# Altium schematic sheet SiLPA_HE_MCU.SchDoc: SiLPA HE
size 420 x 297 mm; EDA_Number: ARTIQ; Projet: ARTIQ/SINARA; Author: G.Kasprowicz; CompanyName: WUT ISE; DrawnBy: G.Kasprowicz; Organization: WUT ISE; Address1: PW ISE; Address2: Nowowiejska 15/19 00-665 Warsaw; Address3: gkasprow@gmail.com; DocumentNumber: 6; Revision: 1; SheetNumber: 7; SheetTotal: 9; ModifiedBy: -; CheckedDate: -; Title2: MCU; DivGrp: WUT ISE; Designer: G.Kasprowicz; ModifiedDate: -; ProjectName: Sensor Box
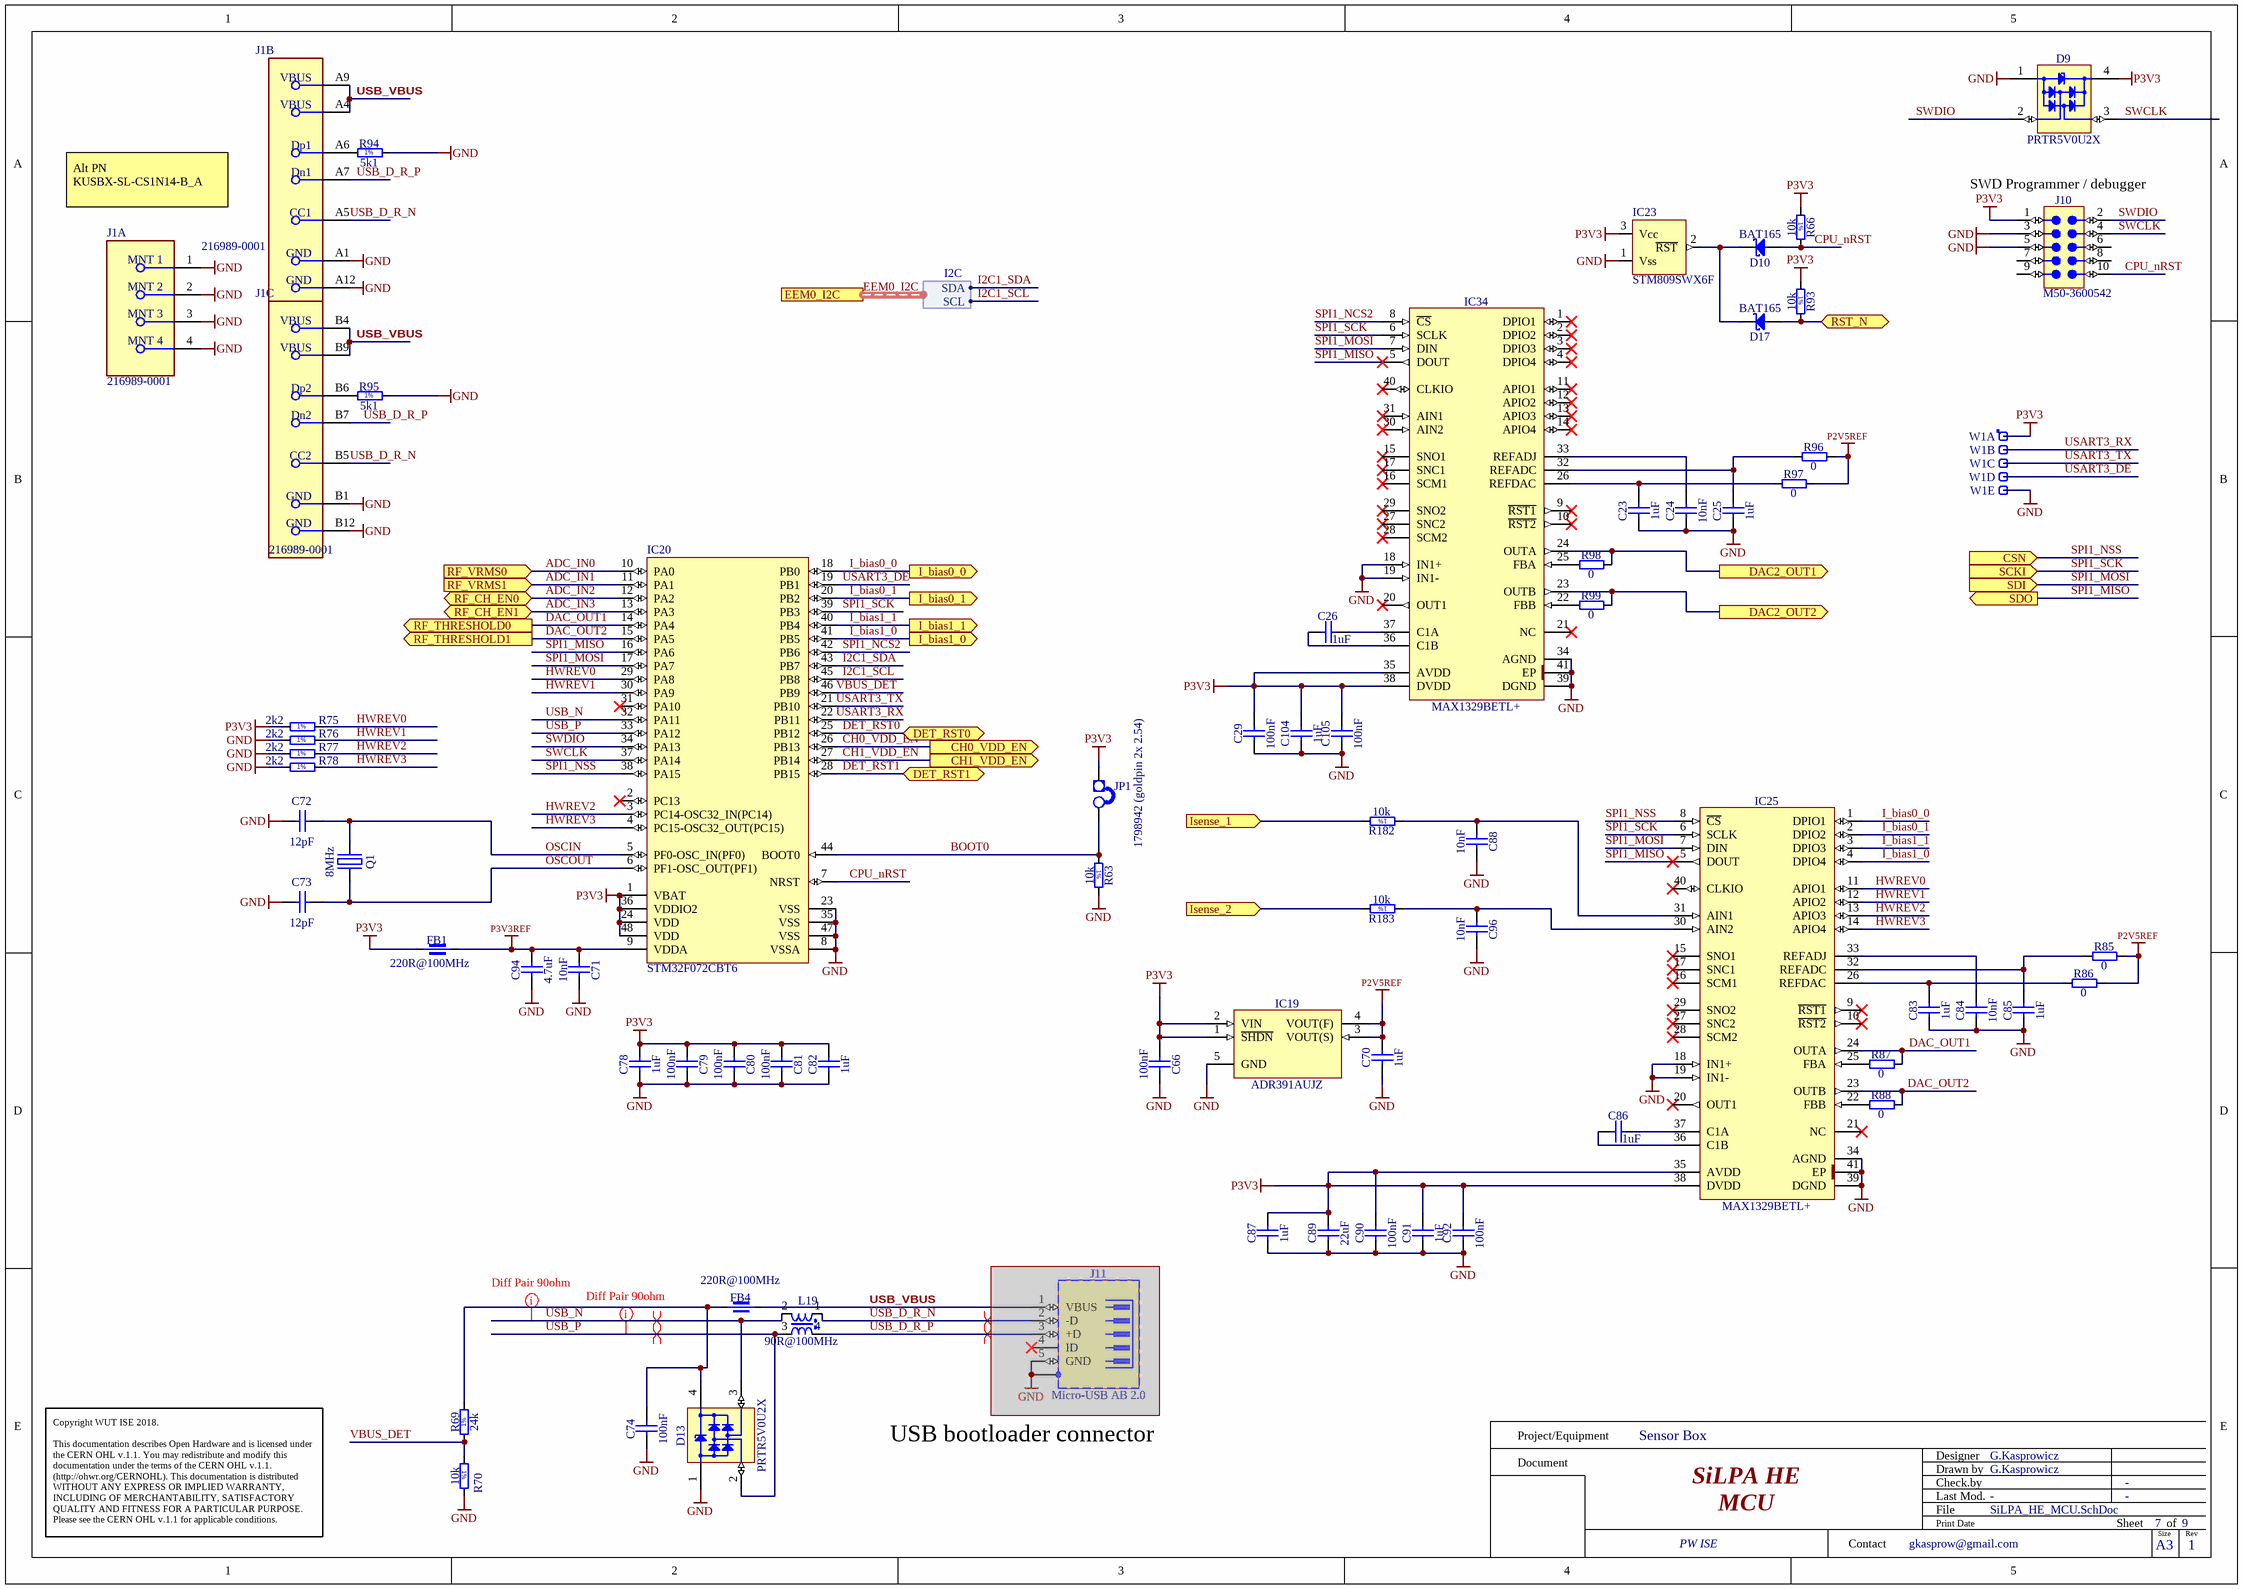
[diagram p0: SiLPA_HE_MCU.SchDoc]

## Parts
C23  1uF  [CAPC1005X55N]
C24  10nF  [CAPC1005X55N]
C25  1uF  [CAPC1005X55N]
C26  1uF  [CAPC1005X55N]
C29  100nF  [CAPC1005X55N]
C66  100nF  [CAPC1005X55N]
C70  1uF  [CAPC1608X87N]
C71  10nF  [CAPC1005X55N]
C72  12pF  [CAPC1005X55N]
C73  12pF  [CAPC1005X55N]
C74  100nF  [CAPC1005X55N]
C78  1uF  [CAPC1608X87N]
C79  100nF  [CAPC1005X55N]
C80  100nF  [CAPC1005X55N]
C81  100nF  [CAPC1005X55N]
C82  1uF  [CAPC1608X87N]
C83  1uF  [CAPC1005X55N]
C84  10nF  [CAPC1005X55N]
C85  1uF  [CAPC1005X55N]
C86  1uF  [CAPC1005X55N]
C87  1uF  [CAPC1608X87N]
C88  10nF  [CAPC1005X55N]
C89  22uF  [CAPC1608X90N]
C90  100nF  [CAPC1005X55N]
C91  1uF  [CAPC1608X87N]
C92  100nF  [CAPC1005X55N]
C94  4.7uF  [CAPC1709X95N]
C96  10nF  [CAPC1005X55N]
C104  1uF  [CAPC1608X87N]
C105  100nF  [CAPC1005X55N]
D9  PRTR5V0U2X  [SOT190P230X110-4N]
D10  BAT165  [SOD2512X110N]
D13  PRTR5V0U2X  [SOT190P230X110-4N]
D17  BAT165  [SOD2512X110N]
FB1  220R@100MHz  [INDC1005X55N]
FB4  220R@100MHz  [INDC1005X55N]
IC19  ADR391AUJZ  [SOT95P280X100-5N]
IC20  STM32F072CBT6  [STM-LQFP48_M]
IC23  STM809SWX6F  [SOT-23]
IC25  MAX1329BETL+  [QFN50P600X600X80-41N-S425]
IC34  MAX1329BETL+  [QFN50P600X600X80-41N-S425]
J1  216989-0001  [FP-2169890001-MFG]  (parts A,B,C of 3)
J10  Manufacturer Part Number: M50-3600542  [HARWIN_M50-3600542]  (hidden comment: Header 10)
J11  Micro-USB AB 2.0  [HIROSE_ZX62RD-AB-5P8]  (masked out: inside a compile mask, not in the netlist)
JP1  1798942 (goldpin 2x 2.54)  [jump]
L19  90R@100MHz  [IND_MURATA_DLW21S]
Q1  8MHz  [XTAL_TXC_7A]
R63  10k  [RESC1005X40N]
R66  10k  [RESC1005X40N]
R69  24k  [RESC1608X55N]
R70  10k  [RESC1005X40N]
R75  2k2  [RESC1005X40N]
R76  2k2  [RESC1005X40N]
R77  2k2  [RESC1005X40N]
R78  2k2  [RESC1005X40N]
R85  0  [RESC1005X40N]
R86  0  [RESC1005X40N]
R87  0  [RESC1005X40N]
R88  0  [RESC1005X40N]
R93  10k  [RESC1005X40N]
R94  5k1  [RESC1005X40N]
R95  5k1  [RESC1005X40N]
R96  0  [RESC1005X40N]
R97  0  [RESC1005X40N]
R98  0  [RESC1005X40N]
R99  0  [RESC1005X40N]
R182  10k  [RESC1005X40N]
R183  10k  [RESC1005X40N]
W1  Header 5  [SAMTEC_HTSW-105-23-L-S]  (value not drawn)  (parts A,B,C,D,E of 5)

## Ports
CH0_VDD_EN (out), CH1_VDD_EN (out), CSN (in), DAC2_OUT1 (out), DAC2_OUT2 (out), DET_RST0 (bidir), DET_RST1 (bidir), EEM0_I2C (harness I2C), I_bias0_0 (out), I_bias0_1 (out), I_bias1_0 (out), I_bias1_1 (out), Isense_1 (in), Isense_2 (in), RF_CH_EN0 (bidir), RF_CH_EN1 (bidir), RF_THRESHOLD0 (out), RF_THRESHOLD1 (out), RF_VRMS0 (in), RF_VRMS1 (in), RST_N (bidir), SCKI (in), SDI (in), SDO (out)

## Harnesses
I2C: SDA, SCL

## Nets
GND: C23.1 C24.1 C25.1 C29.1 C66.2 C70.1 C71.2 C72.2 C73.2 C74.1 C78.1 C79.2 C80.2 C81.2 C82.1 C83.1 C84.1 C85.1 C87.1 C88.2 C89.1 C90.1 C91.1 C92.1 C94.1 C96.2 C104.1 C105.1 D9.1(GND) D13.1(GND) IC19.5(GND) IC20.8(VSSA) IC20.23(VSS) IC20.35(VSS) IC20.47(VSS) IC23.1(Vss) IC25.18(IN1+) IC25.19(IN1-) IC25.34(AGND) IC25.39(DGND) IC25.41(EP) IC34.18(IN1+) IC34.19(IN1-) IC34.34(AGND) IC34.39(DGND) IC34.41(EP) J1.1(MNT_1) J1.2(MNT_2) J1.3(MNT_3) J1.4(MNT_4) J1.A1(GND) J1.A12(GND) J1.B1(GND) J1.B12(GND) J10.3 J10.5 R63.2 R70.2 R76.1 R77.1 R78.1 R94.2 R95.2 W1.5
P2V5REF: C70.2 IC19.3(VOUT(S)) IC19.4(VOUT(F)) R85.2 R86.2 R96.2 R97.2
P3V3: C29.2 C66.1 C78.2 C79.1 C80.1 C81.1 C82.2 C87.2 C89.2 C90.2 C91.2 C92.2 C104.2 C105.2 D9.4(VCC) FB1.1 IC19.1(~{SHDN}) IC19.2(VIN) IC20.1(VBAT) IC20.24(VDD) IC20.36(VDDIO2) IC20.48(VDD) IC23.3(Vcc) IC25.35(AVDD) IC25.38(DVDD) IC34.35(AVDD) IC34.38(DVDD) J10.1 JP1.1(E1) R66.1 R75.1 R93.1 W1.1
P3V3REF: C71.1 C94.2 FB1.2 IC20.9(VDDA)
ADC_IN0: IC20.10(PA0) ; port RF_VRMS0
ADC_IN1: IC20.11(PA1) ; port RF_VRMS1
ADC_IN2: IC20.12(PA2) ; port RF_CH_EN0
ADC_IN3: IC20.13(PA3) ; port RF_CH_EN1
BOOT0: IC20.44(BOOT0) JP1.2(E2) R63.1
CH0_VDD_EN: IC20.26(PB13) ; port CH0_VDD_EN
CH1_VDD_EN: IC20.27(PB14) ; port CH1_VDD_EN
CPU_nRST: D10.2(A) IC20.7(NRST) J10.10 R66.2
DAC2_OUT1: IC34.24(OUTA) R98.2 ; port DAC2_OUT1
DAC2_OUT2: IC34.23(OUTB) R99.2 ; port DAC2_OUT2
DAC_OUT1: IC20.14(PA4) IC25.24(OUTA) R87.2 ; port RF_THRESHOLD0
DAC_OUT2: IC20.15(PA5) IC25.23(OUTB) R88.2 ; port RF_THRESHOLD1
DET_RST0: IC20.25(PB12) ; port DET_RST0
DET_RST1: IC20.28(PB15) ; port DET_RST1
HWREV0: IC20.29(PA8) IC25.11(APIO1) R75.2
HWREV1: IC20.30(PA9) IC25.12(APIO2) R76.2
HWREV2: IC20.3(PC14-OSC32_IN(PC14)) IC25.13(APIO3) R77.2
HWREV3: IC20.4(PC15-OSC32_OUT(PC15)) IC25.14(APIO4) R78.2
I2C1_SCL: IC20.45(PB8) ; port EEM0_I2C.SCL  [project net EEM0_I2C.SCL]
I2C1_SDA: IC20.43(PB7) ; port EEM0_I2C.SDA  [project net EEM0_I2C.SDA]
I_bias0_0: IC20.18(PB0) IC25.1(DPIO1) ; port I_bias0_0
I_bias0_1: IC20.20(PB2) IC25.2(DPIO2) ; port I_bias0_1
I_bias1_0: IC20.41(PB5) IC25.4(DPIO4) ; port I_bias1_0
I_bias1_1: IC20.40(PB4) IC25.3(DPIO3) ; port I_bias1_1
Isense_1: R182.2 ; port Isense_1
Isense_2: R183.2 ; port Isense_2
OSCIN: C72.1 IC20.5(PF0-OSC_IN(PF0)) Q1.1(OSC1)
OSCOUT: C73.1 IC20.6(PF1-OSC_OUT(PF1)) Q1.2(OSC2)
RST_N: D17.2(A) R93.2 ; port RST_N
SPI1_MISO: IC20.16(PA6) IC25.5(DOUT) IC34.5(DOUT) ; port SDO
SPI1_MOSI: IC20.17(PA7) IC25.7(DIN) IC34.7(DIN) ; port SDI
SPI1_NCS2: IC20.42(PB6) IC34.8(~{CS})
SPI1_NSS: IC20.38(PA15) IC25.8(~{CS}) ; port CSN
SPI1_SCK: IC20.39(PB3) IC25.6(SCLK) IC34.6(SCLK) ; port SCKI
SWCLK: D9.3(I/O2) IC20.37(PA14) J10.4
SWDIO: D9.2(I/O1) IC20.34(PA13) J10.2
USART3_DE: IC20.19(PB1) W1.4
USART3_RX: IC20.22(PB11) W1.2
USART3_TX: IC20.21(PB10) W1.3
USB_D_R_N: J1.A5(CC1) J1.B5(CC2) L19.1
USB_D_R_P: J1.A7(Dn1) J1.B7(Dn2) L19.4
USB_N: D13.3(I/O2) IC20.32(PA11) L19.2
USB_P: D13.2(I/O1) IC20.33(PA12) L19.3
USB_VBUS: FB4.2 J1.A4(VBUS) J1.A9(VBUS) J1.B4(VBUS) J1.B9(VBUS)
VBUS_DET: IC20.46(PB9) R69.1 R70.1
NetC23_2: C23.2 IC34.26(REFDAC) R97.1
NetC24_2: C24.2 IC34.33(REFADJ)
NetC25_2: C25.2 IC34.32(REFADC) R96.1
NetC26_1: C26.1 IC34.36(C1B)
NetC26_2: C26.2 IC34.37(C1A)
NetC74_2: C74.2 D13.4(VCC) FB4.1 R69.2
NetC83_2: C83.2 IC25.26(REFDAC) R86.1
NetC84_2: C84.2 IC25.33(REFADJ)
NetC85_2: C85.2 IC25.32(REFADC) R85.1
NetC86_1: C86.1 IC25.36(C1B)
NetC86_2: C86.2 IC25.37(C1A)
NetC88_1: C88.1 IC25.31(AIN1) R182.1
NetC96_1: C96.1 IC25.30(AIN2) R183.1
NetD10_1: D10.1(C) D17.1(C) IC23.2(~{RST})
NetIC25_22: IC25.22(FBB) R88.1
NetIC25_25: IC25.25(FBA) R87.1
NetIC34_22: IC34.22(FBB) R99.1
NetIC34_25: IC34.25(FBA) R98.1
NetJ1_A6: J1.A6(Dp1) R94.1
NetJ1_B6: J1.B6(Dp2) R95.1

Not connected (* = marked no-connect by the designer): IC20 2(PC13)* 31(PA10)*; IC25 9(~{RST1})* 10(~{RST2})* 15(SNO1)* 16(SCM1)* 17(SNC1)* 20(OUT1)* 21(NC)* 27(SNC2)* 28(SCM2)* 29(SNO2)* 40(CLKIO)*; IC34 1(DPIO1)* 2(DPIO2)* 3(DPIO3)* 4(DPIO4)* 9(~{RST1})* 10(~{RST2})* 11(APIO1)* 12(APIO2)* 13(APIO3)* 14(APIO4)* 15(SNO1)* 16(SCM1)* 17(SNC1)* 20(OUT1)* 21(NC)* 27(SNC2)* 28(SCM2)* 29(SNO2)* 30(AIN2)* 31(AIN1)* 40(CLKIO)*; J10 6 7 8 9

## Buses and harness runs
harness EEM0_I2C = port EEM0_I2C

## Layout directives
mark named Diff Pair 90ohm: USB_N, USB_P
differential pair: USB_D_R_N, USB_D_R_P, USB_N, USB_P

## Notes on the sheet
- (near J10) SWD Programmer / debugger
- Alt PN KUSBX-SL-CS1N14-B_A
- (near J11) USB bootloader connector
- Project/Equipment
- Document
- Designer
- Drawn by
- Check.by
- Copyright WUT ISE 2018.
  This documentation describes Open Hardware and is licensed under the CERN OHL v.1.1. You may redistribute and modify this documentation under the terms of the CERN OHL v.1.1. (http://ohwr.org/CERNOHL). This documentation is distributed WITHOUT ANY EXPRESS OR IMPLIED WARRANTY, INCLUDING OF MERCHANTABILITY, SATISFACTORY QUALITY AND FITNESS FOR A PARTICULAR PURPOSE. Please see the CERN OHL v.1.1 for applicable conditions.
- Contact
- File
- Last Mod.
- Print Date
- Sheet
- Size
- A3
- of
- Rev
- (in symbol R0402_2K2_1%_0.0625W_100PPM) 1%
- (in symbol R0402_5K1_1%_0.0625W_100PPM) 1%
- (in symbol R0402_10K_1%_0.0625W_100PPM) 1%
- (in symbol R0603_24K_1%_0.1W_100PPM) 1%

## Library data of the parts
C23 C25 C26 C83 C85 C86 = CC0402_1UF_16V_10%_X5R: Non-polarised capacitor; Part Description: SMD Multilayer Chip Ceramic Capacitor; Manufacturer: GENERIC; Manufacturer1 Part Number: C1005X5R1C105KT; Voltage: 16V; TC: X5R; Tolerance: ±10%; Part Number: CC0402_1UF_16V_10%_X5R; Component Kind: Standard; Component Type: Standard; Pin Count: 2; Value: 1uF; Status: Preferred; Manufacturer Part Number: CC0402_1UF_16V_10%_X5R; Case: 0402; Mounted: Yes; Socket: No; SMD: Yes; Sense: No; Manufacturer1 Example: TDK; Manufacturer1 ComponentHeight: 0.55mm; HelpURL: \\cern.ch\dfs\Applications\Altium\Datasheets\CC0402_X5R_TDK_C.pdf; Author: CERN DEM JLC; CreateDate: 25.10.2012; LatestRevisionDate: 25.10.2012
C24 C71 C84 C88 C96 = CC0402_10NF_16V_10%_X7R: Non-polarised capacitor; Part Description: SMD Multilayer Chip Ceramic Capacitor; Manufacturer: GENERIC; Manufacturer1 Part Number: 223878715636; Voltage: 16V; TC: X7R; Tolerance: ±10%; Part Number: CC0402_10NF_16V_10%_X7R; Component Kind: Standard; Component Type: Standard; Pin Count: 2; Value: 10nF; Status: Not Recommended; Manufacturer Part Number: CC0402_10NF_16V_10%_X7R; Case: 0402; Mounted: Yes; Socket: No; SMD: Yes; Sense: No; Manufacturer1 Example: PHYCOMP; Manufacturer1 ComponentHeight: 0.55mm; HelpURL: \\cern.ch\dfs\Applications\Altium\Datasheets\CC0402_X7R_PHYCOMP.pdf; Author: CERN DEM JLC
  C24 C84: CreateDate: 03-Dec-07; LatestRevisionDate: 03-Dec-07
  C71 C88 C96: CreateDate: 03.12.2007; LatestRevisionDate: 03.12.2007
C29 C90 C92 C105 = CC0402_100NF_16V_10%_X5R: Non-polarised capacitor; Part Description: SMD Multilayer Chip Ceramic Capacitor; Manufacturer: GENERIC; Manufacturer1 Part Number: GRM155R61C104KA88D; Voltage: 16V; TC: X5R; Tolerance: ±10%; Part Number: CC0402_100NF_16V_10%_X5R; Component Kind: Standard; Component Type: Standard; Pin Count: 2; Value: 100nF; Status: None; Manufacturer Part Number: CC0402_100NF_16V_10%_X5R; Case: 0402; Mounted: Yes; Socket: No; SMD: Yes; Sense: No; Manufacturer1 Example: MURATA; Manufacturer1 ComponentHeight: 0.55mm; HelpURL: \\cern.ch\dfs\Applications\Altium\Datasheets\CC0402_X5R_MURATA_GRM.pdf; Author: CERN DEM JLC; CreateDate: 10.12.2013; LatestRevisionDate: 10.12.2013
C66 C79-C81 = CC0402_100NF_16V_10%_X5R: Non-polarised capacitor; Part Description: SMD Multilayer Chip Ceramic Capacitor; Manufacturer: GENERIC; Manufacturer1 Part Number: GRM155R61C104KA88D; Voltage: 16V; TC: X5R; Tolerance: ±10%; Table: Capacitors SMD; Part Number: CC0402_100NF_16V_10%_X5R; Component Kind: Standard; Component Type: Standard; Pin Count: 2; Value: 100nF; Status: None; Manufacturer Part Number: CC0402_100NF_16V_10%_X5R; Case: 0402; Mounted: Yes; Socket: No; SMD: Yes; Manufacturer1 Example: MURATA; Manufacturer1 ComponentHeight: 0.55mm; HelpURL: \\cern.ch\dfs\Applications\Altium\Datasheets\CC0402_X5R_MURATA_GRM.pdf; Author: CERN DEM JLC; CreateDate: 2013-12-10; LatestRevisionDate: 2013-12-10
C70 = CC0603_1UF_25V_10%_X7R_1: Non-polarised capacitor; Part Description: SMD Multilayer Chip Ceramic Capacitor; Manufacturer: GENERIC; Manufacturer1 Part Number: GRM188R71E105KA12D; Voltage: 25V; TC: X7R; Tolerance: ±10%; Part Number: CC0603_1UF_25V_10%_X7R; Component Kind: Standard; Component Type: Standard; Pin Count: 2; Value: 1uF; Status: None; Manufacturer Part Number: CC0603_1UF_25V_10%_X7R; Case: 0603; Mounted: Yes; Socket: No; SMD: Yes; Sense: No; Manufacturer1 Example: MURATA; Manufacturer1 ComponentHeight: 0.9mm; HelpURL: \\cern.ch\dfs\Applications\Altium\Datasheets\CC0603_X7R_MURATA.pdf; Author: CERN DEM JLC; CreateDate: 18.01.2011; LatestRevisionDate: 18.01.2011
C72 C73 = CC0402_12PF_50V_5%_C0G: Non-polarised capacitor; Part Description: SMD Multilayer Chip Ceramic Capacitor; Manufacturer: GENERIC; Manufacturer1 Part Number: C0402C120J5GACTU; Voltage: 50V; TC: C0G/NP0; Tolerance: ±5%; Part Number: CC0402_12PF_50V_5%_C0G; Component Kind: Standard; Component Type: Standard; Pin Count: 2; Value: 12pF; Status: Preferred; Manufacturer Part Number: CC0402_12PF_50V_5%_C0G; Case: 0402; Mounted: Yes; Socket: No; SMD: Yes; Sense: No; Manufacturer1 Example: KEMET; Manufacturer1 ComponentHeight: 0.55mm; HelpURL: \\cern.ch\dfs\Applications\Altium\Datasheets\CC0805_C0G_KEMET_(Commercial Grade).pdf; Author: CERN DEM JLC; CreateDate: 04.10.2016; LatestRevisionDate: 04.10.2016
C74 = CC0402_100NF_16V_10%_X7R: Non-polarised capacitor; Part Description: SMD Multilayer Chip Ceramic Capacitor; Manufacturer: GENERIC; Manufacturer1 Part Number: GRM155R71C104KA88D; Voltage: 16V; TC: X7R; Tolerance: ±10%; Part Number: CC0402_100NF_16V_10%_X7R; Component Kind: Standard; Component Type: Standard; Pin Count: 2; Value: 100nF; Status: Not Recommended; Manufacturer Part Number: CC0402_100NF_16V_10%_X7R; Case: 0402; Mounted: Yes; Socket: No; SMD: Yes; Manufacturer1 Example: MURATA; Manufacturer1 ComponentHeight: 0.55mm; HelpURL: \\cern.ch\dfs\Applications\Altium\Datasheets\CC0402_X7R_MURATA_GRM.pdf; Author: CERN DEM JLC; CreateDate: 05.12.2013; LatestRevisionDate: 03.12.2007; Sense: No
C78 C82 = CC0603_1UF_16V_10%_X7R: Non-polarised capacitor; Part Description: SMD Multilayer Chip Ceramic Capacitor; Manufacturer: GENERIC; Manufacturer1 Part Number: 223878615663; Voltage: 16V; TC: X7R; Tolerance: ±10%; Part Number: CC0603_1UF_16V_10%_X7R; Component Kind: Standard; Component Type: Standard; Pin Count: 2; Value: 1uF; Status: None; Manufacturer Part Number: CC0603_1uF_16V_10%_X7R; Case: 0603; Mounted: Yes; Socket: No; SMD: Yes; Sense: No; Manufacturer1 Example: YAGEO PHYCOMP; Manufacturer1 ComponentHeight: 0.9mm; HelpURL: \\cern.ch\dfs\Applications\Altium\Datasheets\CC0603_X7R_PHYCOMP.pdf; Author: CERN DEM JLC; CreateDate: 03.12.2007; LatestRevisionDate: 17.04.2015
C87 C91 C104 = CC0603_1UF_25V_10%_X7R: Non-polarised capacitor; Part Description: SMD Multilayer Chip Ceramic Capacitor; Manufacturer: GENERIC; Manufacturer1 Part Number: GRM188R71E105KA12D; Voltage: 25V; TC: X7R; Tolerance: ±10%; Part Number: CC0603_1UF_25V_10%_X7R; Component Kind: Standard; Component Type: Standard; Pin Count: 2; Value: 1uF; Status: None; Manufacturer Part Number: CC0603_1UF_25V_10%_X7R; Case: 0603; Mounted: Yes; Socket: No; SMD: Yes; Sense: No; Manufacturer1 Example: MURATA; Manufacturer1 ComponentHeight: 0.9mm; HelpURL: \\cern.ch\dfs\Applications\Altium\Datasheets\CC0603_X7R_MURATA.pdf; Author: CERN DEM JLC; CreateDate: 18.01.2011; LatestRevisionDate: 18.01.2011
C89 = CC0603_22UF_6.3V_20%_X5R: Non-polarised capacitor; Part Description: SMD Multilayer Chip Ceramic Capacitor; Manufacturer: GENERIC; Manufacturer1 Part Number: C1608X5R0J226M080; Voltage: 6.3V; TC: X5R; Tolerance: ±20%; Part Number: CC0603_22UF_6.3V_20%_X5R; Component Kind: Standard; Component Type: Standard; Pin Count: 2; Value: 22uF; Status: None; Manufacturer Part Number: CC0603_22UF_6.3V_20%_X5R; Case: 0603; Mounted: Yes; Socket: No; SMD: Yes; Sense: No; Manufacturer1 Example: TDK; Manufacturer1 ComponentHeight: 0.9mm; HelpURL: \\cern.ch\dfs\Applications\Altium\Datasheets\CC0603_X5R_TDK_C.pdf; Author: CERN DEM JLC; CreateDate: 16.12.2013; LatestRevisionDate: 03.12.2020
C94 = CC0603_4.7UF_16V_10%_X5R: Non-polarised capacitor; Part Description: SMD Multilayer Chip Ceramic Capacitor; Manufacturer: GENERIC; Manufacturer1 Part Number: EMK107ABJ475KA-T; Voltage: 16V; TC: X5R; Tolerance: ±10%; Part Number: CC0603_4.7UF_16V_10%_X5R; Component Kind: Standard; Component Type: Standard; Pin Count: 2; Value: 4.7uF; Status: None; Manufacturer Part Number: CC0603_4.7UF_16V_10%_X5R; Case: 0603; Mounted: Yes; Socket: No; SMD: Yes; Sense: No; Manufacturer1 Example: TAIYO YUDEN; Manufacturer1 ComponentHeight: 0.95mm; HelpURL: \\cern.ch\dfs\Applications\Altium\Datasheets\CC0603_X7R_TAIYO-YUDEN_HIGH-VALUE.pdf; Author: CERN DEM JLC; CreateDate: 16.12.2013; LatestRevisionDate: 16.09.2014
D9 D13 = PRTR5V0U2X: Ultra Low Capacitance Double Rail-to-Rail ESD Protection Diode; Part Description: Ultra Low Capacitance (1pF) Double Rail-to-Rail ESD Protection Diode (8kV); Manufacturer: NXP SEMICONDUCTORS; Voltage: 5.5V; PressFit: No; Bonding: No; Part Number: PRTR5V0U2X; Component Kind: Standard; Component Type: Standard; Device: PRTR5V0U2X; PackageDescription: SOT143B, SOT, 1.90mm Pitch; 4 Pin, 1.30mm W X 2.90mm L X 1.10mm H body, IPC Medium Density; Manufacturer Part Number: PRTR5V0U2X; Pin Count: 4; Case: SOT143B; Mounted: Yes; Socket: No; SMD: Yes; Sense: No; ComponentHeight: 1.1mm; HelpURL: \\cern.ch\dfs\Applications\Altium\Datasheets\PRTR5V0U2X.pdf; Author: CERN DEM JLC; CreateDate: 22.03.2011; LatestRevisionDate: 22.03.2011
D10 D17 = BAT165: Schottky Diode; Part Description: Medium Power AF Schottky Diode; Manufacturer: INFINEON; Voltage: 40V; Power: 750mA; PressFit: No; Bonding: No; Part Number: BAT165; Component Kind: Standard; Component Type: Standard; Device: BAT165; PackageDescription: Small Outline Diode Flat Lead (SOD-323), 1.70mm W X 1.25mm L X 1.10mm H body,  IPC Medium Density; Manufacturer Part Number: BAT165; Pin Count: 2; Case: SOD323; Mounted: Yes; Socket: No; SMD: Yes; Sense: No; ComponentHeight: 1.1mm; HelpURL: \\cern.ch\dfs\Applications\Altium\Datasheets\BAT165.pdf; Author: CERN DEM JLC; CreateDate: 12.11.2014; LatestRevisionDate: 12.11.2014
FB1 FB4 = IND0402_MURATA_BLM15HB221SN1: Part Description: SMD EMIFIL Suppression Chip Ferrite Bead; Manufacturer: MURATA; Power: 250mA; Resistance: 1R; Tolerance: ±25%; Part Number: IND0402_MURATA_BLM15HB221SN1; Component Kind: Standard; Component Type: Standard; Pin Count: 2; Value: 220R@100MHz; Status: None; Manufacturer Part Number: BLM15HB221SN1; Case: 0402; Mounted: Yes; Socket: No; SMD: Yes; ComponentHeight: 0.55mm; HelpURL: \\cern.ch\dfs\Applications\Altium\Datasheets\IND0402_MURATA_BLM15H.pdf; Author: CERN DEM JLC; CreateDate: 23.06.2009; LatestRevisionDate: 25.10.2018; Sense: No
IC19 = ADR391AUJZ: 2.5V Micropower, Low Noise Precision Voltage References with Shutdown; Manufacturer: ANALOG DEVICES; PressFit: No; Bonding: No; Part Number: ADR391AUJZ; Component Kind: Standard; Component Type: Standard; Device: ADR391AUJZ; PackageDescription: SOT23, 0.95mm Pitch; 5 Pin, 1.75mm W X 3.00mm L X 1.00mm H body, IPC Medium Density; Part Description: 2.5V Micropower, Low Noise Precision Voltage References with Shutdown; Manufacturer Part Number: ADR391AUJ; Pin Count: 5; Case: SOT23-5; Mounted: Yes; Socket: No; SMD: Yes; Sense: No; ComponentHeight: 1.0mm; HelpURL: \\cern.ch\dfs\Applications\Altium\Datasheets\ADR391AUJZ.pdf; Author: CERN DEM JLC; CreateDate: 21.03.2019; LatestRevisionDate: 04.04.2022
IC20 = CMP-0304-00170-4: ARM Cortex-M0 32-bit MCU, 128 KB Flash, 16 KB Internal RAM, 37 I/Os, 48-Pin LQFP, -40 to 85 degC, Tray; Manufacturer: STMicroelectronics; I/Os (High Current): 37; Operating Frequency(F) (Processor speed) (MHz): 48; FLASH Size (Prog) (kB): 128; Internal RAM Size (kB): 16; D/A Converter: 1; Supply Voltage(Vcc) min (V): 2; ComponentLink2URL: http://www.st.com/st-web-ui/static/active/en/resource/technical/document/datasheet/DM00090510.pdf; Packing: Tray; DatasheetVersion: Rev. 5; ComponentLink2Description: Datasheet; Package Reference: LQFP48; Core: ARM Cortex-M0; PartNumber: STM32F072CBT6; ComponentLink1Description: Manufacturer URL; Package Description: 48-Pin Low Profile Quad Flat Package, Body 7 x 7 mm, Pitch 0.5 mm; ComponentLink1URL: http://www.st.com/; Mounting Technology: Surface Mount
IC23 = VMON_STM809: 2.93V  Reset circuit
IC25 IC34 = MAX1329BETL+: 12-/16-Bit DAS with ADC, DACs, DPIOs, APIOs, Reference, Voltage Monitors, and Temp Sensor; Manufacturer: MAXIM; PressFit: No; Bonding: No; Part Number: MAX1329BETL+; Component Kind: Standard; Component Type: Standard; Device: MAX1329BETL+; PackageDescription: QFN, 0.50mm Pitch, Square; 40 Pin, 6.00mm L X 6.00mm W X 0.80mm H body (w/Thermal Tab 4.25 X 4.25mm), IPC Medium Density; Part Description: 12-/16-Bit DAS with ADC, DACs, DPIOs, APIOs, Reference, Voltage Monitors, and Temp Sensor; Manufacturer Part Number: MAX1329BETL; Pin Count: 41; Case: QFN40; Mounted: Yes; Socket: No; SMD: Yes; Sense: No; ComponentHeight: 0.8mm; Author: CERN DEM HF; HelpURL: \\cern.ch\dfs\Applications\Altium\Datasheets\MAX1329BETL+.pdf; CreateDate: 09.02.2022; LatestRevisionDate: 04.04.2022
J1 = CMP-04767-000020-2: CONN RCPT USB2.0 TYPE C 24POS RA; NexarPartId: 117235448; Gender: Receptacle; Number of Contacts: 14; Voltage Rating: 30V; Current Rating: 1.25A; USB Standard: USB 2.0; Contact Material: Gold, Nickel; Height: 9.14mm; Schedule B: 8536695050; Max Operating Temperature: 85°C; Min Operating Temperature: -40°C
J10 = CON_2x10 1.27 SMT_male_HARWIN: 10 Contacts - Pitch 1.27mm - Dual Row SMT Vertical Pin Header (Post Lead = 3mm, Insulator 1mm); Manufacturer: HARWIN; PressFit: No; Part Number: HARWIN_M50-3600542; Component Kind: Standard; Component Type: Standard; Pin Count: 10; Family: Header 10; Mounted: Yes; Socket: No; SMD: Yes; Sense: No; Status: None; Part Description: 10 Contacts - Pitch 1.27mm - Dual Row SMT Vertical Pin Header (Post Lead = 3mm, Insulator 1mm); ComponentHeight: 5.13mm; HelpURL: \\cern.ch\dfs\Applications\Altium\Datasheets\HARWIN_M50-3600842.pdf; Author: GK; CreateDate: 15.03.2017; LatestRevisionDate: 22.05.2017
J11 = HIROSE_ZX62RD-AB-5P8: 5 Pin + 1 Shield USB Receptacle; Part Description: Micro-USB 2.0 Right Angle, SMD Type AB - Reverse (Top mount), Shell Through Hole; Manufacturer: HIROSE (HRS); PressFit: No; Part Number: HIROSE_ZX62RD-AB-5P8; Component Kind: Standard; Component Type: Standard; Pin Count: 7; Family: Micro-USB AB 2.0; Mounted: Yes; Socket: No; SMD: Yes; Sense: No; Status: None; Manufacturer Part Number: ZX62RD-AB-5P8; ComponentHeight: 2.35mm; HelpURL: \\cern.ch\dfs\Applications\Altium\Datasheets\HIROSE_ZX62RD-AB-5P8.pdf; ComponentLink1URL: \\cern.ch\dfs\Applications\Altium\Datasheets\HIROSE_ZX62RD-AB-5P8_Package-Drawing.pdf; ComponentLink1Description: Package-Drawing; Author: CERN DEM JLC; CreateDate: 29.10.2014; LatestRevisionDate: 29.10.2014; ClassName: Connectors
JP1 = JUMPER: Supplier 1: Farnell; Supplier Part Number 1: 1798942
L19 = IND_MURATA_DLW21SN900SQ2L: Inductor Common Mode; Part Description: Wire Wound Common Mode Choke Coil (DLW21S Series); Manufacturer: MURATA; Power: 330mA; Resistance: 0.35R; Tolerance: ±25%; Part Number: IND_MURATA_DLW21SN900SQ2L; Component Kind: Standard; Component Type: Standard; Pin Count: 4; Value: 90R@100MHz; Status: None; Manufacturer Part Number: DLW21SN900SQ2L; Case: 0805; Mounted: Yes; Socket: No; SMD: Yes; Sense: No; ComponentHeight: 1.4mm; HelpURL: \\cern.ch\dfs\Applications\Altium\Datasheets\IND_MURATA_DLW21S.pdf; Author: CERN DEM JLC; CreateDate: 01.07.2014; LatestRevisionDate: 01.07.2014
Q1 = XTAL_8MHZ_TXC_7A-8.000MAAE-T: Quartz Crystal; Part Description: Tolerance: ±30ppm, Stability: ±30ppm, -20°C to +70°C, 12pF, SMD Glass Seam Sealing Crystal, 7A Series; Manufacturer: TXC CORPORATION; PressFit: No; Bonding: No; Part Number: XTAL_8MHZ_TXC_7A-8.000MAAE-T; Component Kind: Standard; Component Type: Standard; PackageDescription: 2 Pins, 3.2x5mm, SMD Glass Seam Sealing Crystal, 7A Serie; Value: 8MHz; Manufacturer Part Number: 7A-8.000MAAE-T; Pin Count: 2; Mounted: Yes; Socket: No; SMD: Yes; Sense: No; ComponentHeight: 1.2mm; HelpURL: \\cern.ch\dfs\Applications\Altium\Datasheets\XTAL_TXC_7A.pdf; Author: CERN DEM JLC; CreateDate: 09.10.2014; LatestRevisionDate: 12.11.2014
R63 R66 R93 R182 R183 = R0402_10K_1%_0.0625W_100PPM: Resistor - 1%; Part Description: General Purpose Thick Film Chip Resistor; Manufacturer: GENERIC; Manufacturer1 Part Number: 232270671003L; TC: ±100ppm/°C; Table: Resistors SMD; Part Number: R0402_10K_1%_0.0625W_100PPM; Component Kind: Standard; Component Type: Standard; Pin Count: 2; Value: 10k; Status: Not recommended; Power: 0.0625W; Tolerance: ±1%; Manufacturer Part Number: R0402_10K_1%_0.0625W_100PPM; Case: 0402; Mounted: Yes; Socket: No; SMD: Yes; Manufacturer1 Example: YAGEO PHYCOMP; Manufacturer1 ComponentHeight: 0.4mm; HelpURL: \\cern.ch\dfs\Applications\Altium\Datasheets\R0402_Phycomp_RC0402.pdf; Author: CERN DEM JLC; CreateDate: 2007-12-03; LatestRevisionDate: 2012-10-17
R69 = R0603_24K_1%_0.1W_100PPM: Resistor - 1%; Part Description: General Purpose Thick Film Chip Resistor; Manufacturer: GENERIC; Manufacturer1 Part Number: NRC06F2402TRF; Power: 0.1W; TC: ±100ppm/°C; Part Number: R0603_24K_1%_0.1W_100PPM; Component Kind: Standard; Component Type: Standard; Pin Count: 2; Value: 24k; Status: Preferred; Tolerance: ±1%; Manufacturer Part Number: R0603_24K_1%_0.1W_100PPM; Case: 0603; Mounted: Yes; Sense: No; Socket: No; SMD: Yes; Manufacturer1 Example: NIC COMPONENT; Manufacturer1 ComponentHeight: 0.55mm; HelpURL: \\cern.ch\dfs\Applications\Altium\Datasheets\R0603_NIC_NRC.pdf; Author: CERN DEM JLC; CreateDate: 03.12.2007; LatestRevisionDate: 13.03.2008
R70 = R0402_10K_1%_0.0625W_100PPM: Resistor - 1%; Part Description: General Purpose Thick Film Chip Resistor; Manufacturer: GENERIC; Manufacturer1 Part Number: 232270671003L; TC: ±100ppm/°C; PressFit: No; Part Number: R0402_10K_1%_0.0625W_100PPM; Component Kind: Standard; Component Type: Standard; Pin Count: 2; Value: 10k; Status: Not Recommended; Power: 0.0625W; Tolerance: ±1%; Manufacturer Part Number: R0402_10K_1%_0.0625W_100PPM; Case: 0402; Mounted: Yes; Sense: No; Socket: No; SMD: Yes; Manufacturer1 Example: YAGEO PHYCOMP; Manufacturer1 ComponentHeight: 0.4mm; HelpURL: \\cern.ch\dfs\Applications\Altium\Datasheets\R0402_Phycomp_RC0402.pdf; Author: CERN DEM JLC; CreateDate: 03.12.2007; LatestRevisionDate: 17.10.2012
R75-R78 = R0402_2K2_1%_0.0625W_100PPM: Resistor - 1%; Part Description: General Purpose Thick Film Chip Resistor; Manufacturer: GENERIC; Manufacturer1 Part Number: 232270672202L; TC: ±100ppm/°C; Part Number: R0402_2K2_1%_0.0625W_100PPM; Component Kind: Standard; Component Type: Standard; Pin Count: 2; Value: 2k2; Status: Not recommended; Power: 0.0625W; Tolerance: ±1%; Manufacturer Part Number: R0402_2K2_1%_0.0625W_100PPM; Case: 0402; Mounted: Yes; Sense: No; Socket: No; SMD: Yes; Manufacturer1 Example: YAGEO PHYCOMP; Manufacturer1 ComponentHeight: 0.4mm; HelpURL: \\cern.ch\dfs\Applications\Altium\Datasheets\R0402_Phycomp_RC0402.pdf; Author: CERN DEM JLC; CreateDate: 03.12.2007; LatestRevisionDate: 17.10.2012
R85-R88 R96-R99 = R0402_0R_JUMPER: Resistor; Part Description: 1A (0.05R Max DC Resistance) Zero Ohm Jumper; Manufacturer: GENERIC; Manufacturer1 Part Number: 232270591001L; PressFit: No; Part Number: R0402_0R_JUMPER; Component Kind: Standard; Component Type: Standard; Pin Count: 2; Value: 0; Status: Not Recommended; Manufacturer Part Number: R0402_0R_JUMPER; Case: 0402; Mounted: Yes; Sense: No; Socket: No; SMD: Yes; Manufacturer1 Example: YAGEO PHYCOMP; Manufacturer1 ComponentHeight: 0.4mm; HelpURL: \\cern.ch\dfs\Applications\Altium\Datasheets\R0402_Phycomp_RC0402.pdf; Author: CERN DEM JLC; CreateDate: 03.12.2007; LatestRevisionDate: 17.10.2012
R94 R95 = R0402_5K1_1%_0.0625W_100PPM: Resistor - 1%; Part Description: General Purpose Thick Film Chip Resistor; Manufacturer: GENERIC; Manufacturer1 Part Number: 232270675102L; TC: ±100ppm/°C; PressFit: No; Part Number: R0402_5K1_1%_0.0625W_100PPM; Component Kind: Standard; Component Type: Standard; Pin Count: 2; Value: 5k1; Status: Not Recommended; Power: 0.0625W; Tolerance: ±1%; Manufacturer Part Number: R0402_5K1_1%_0.0625W_100PPM; Case: 0402; Mounted: Yes; Sense: No; Socket: No; SMD: Yes; Manufacturer1 Example: YAGEO PHYCOMP; Manufacturer1 ComponentHeight: 0.4mm; HelpURL: \\cern.ch\dfs\Applications\Altium\Datasheets\R0402_Phycomp_RC0402.pdf; Author: CERN DEM JLC; CreateDate: 03.12.2007; LatestRevisionDate: 17.10.2012
W1 = SAMTEC_HTSW-105-23-L-S: 5 Mini Wire-Wrap Contact Strip Header; Part Description: 5 Contacts, Pitch 2.54mm, Single Row  Through Mount Straight Header (Post Lead 5.84mm, Tail Lead 2.92mm, Insulator 2.54mm); Manufacturer: SAMTEC; PressFit: No; Status Comment: High Temperature; Part Number: SAMTEC_HTSW-105-23-L-S; Component Kind: Standard; Component Type: Standard; Pin Count: 5; Family: Header 5; Mounted: Yes; Socket: No; SMD: No; Sense: No; Status: Preferred; Manufacturer Part Number: HTSW-105-23-L-S; ComponentHeight: 8.38mm; HelpURL: \\cern.ch\dfs\Applications\Altium\Datasheets\SAMTEC_HTSW-105-23-L-S.pdf; Author: CERN DEM JLC; CreateDate: 22.02.2018; LatestRevisionDate: 22.02.2018